# EAGLE board F2CE_V3_Main (EAGLE 9.6.2), part 1 of 2
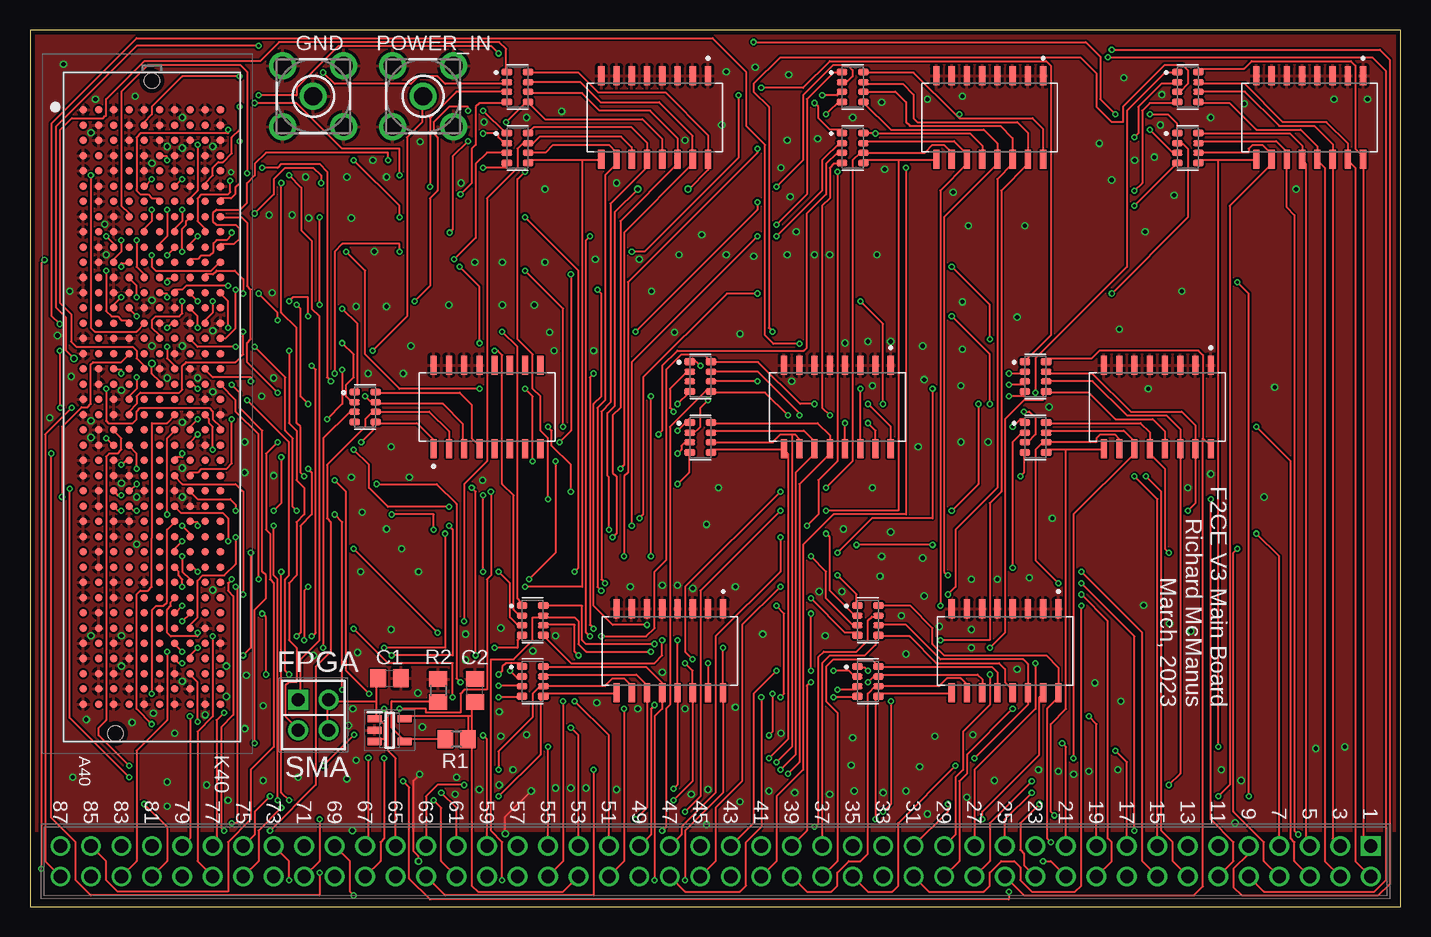
[diagram p4: board, top side]
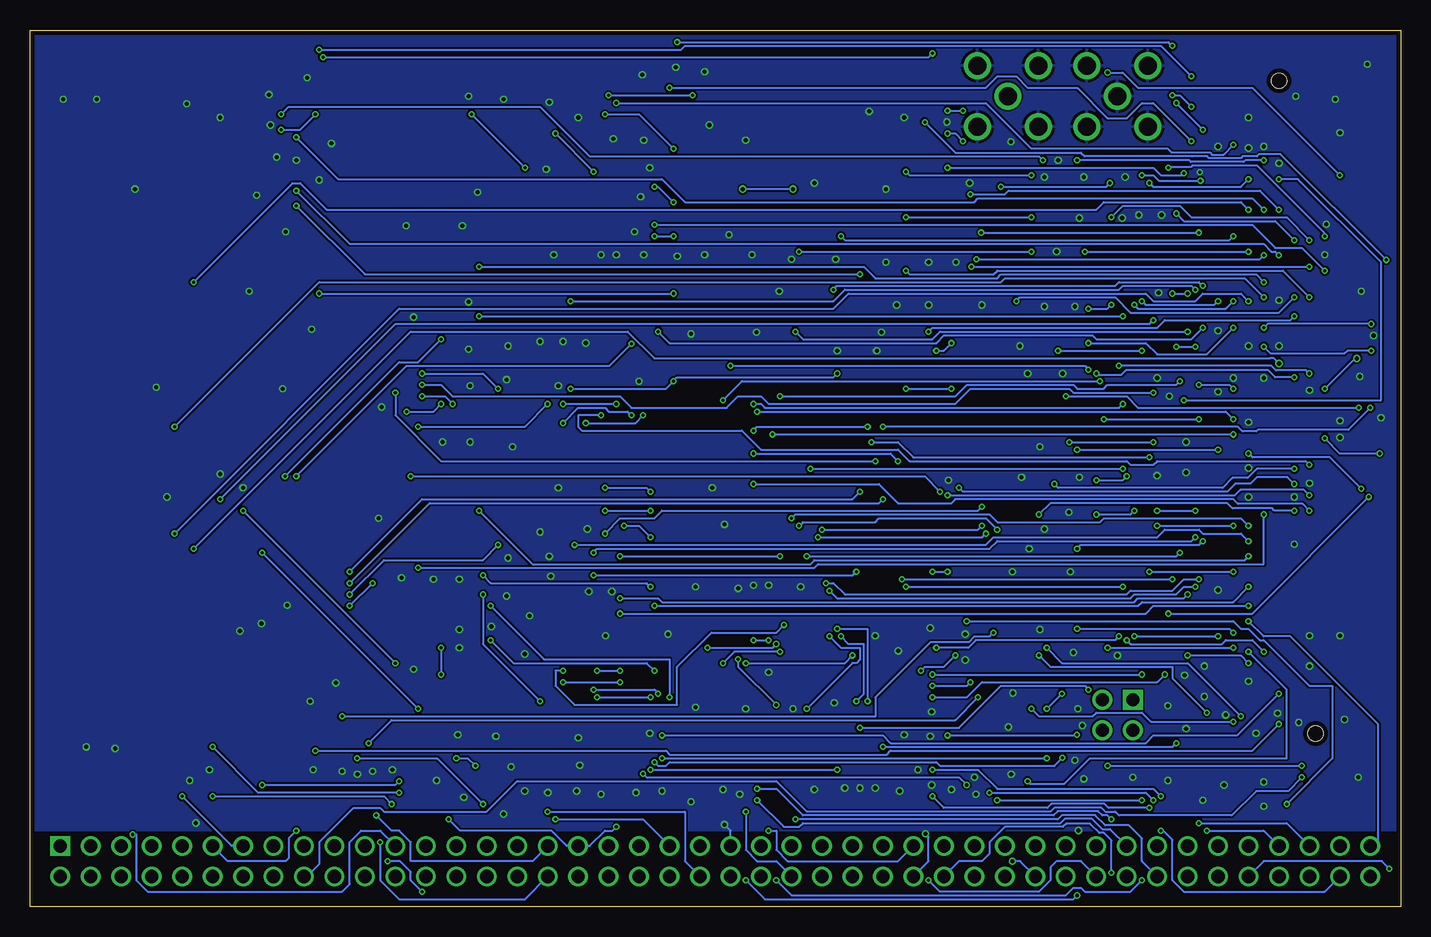
[diagram p5: board, bottom side, seen from below]

Size 114.28 x 73.08 mm. Coordinates in mm from the lower left corner, seen from the top.
Outline: 0,0 114.28,0 114.28,73.08 0,73.08 0,0
Copper layers (1*16): Top 0.035559375mm / dielectric 1.6mm / Bottom 0.035559375mm
Design rules "oshpark-2layer *": minimum track width 6mil, minimum drill 10mil, track to track 6mil, track to pad 6mil, pad to pad 6mil, via to via 6mil, smd to smd 6mil, copper to edge 15mil, drill to drill 6mil, minimum pad ring 5mil, minimum via ring 5mil, stop-mask expansion 2.5mil, vias tented up to drill 15mil, thermal gap 10mil

## Footprints (pad centres in the part's own frame; a part is rotated, then mirrored left to right if it is on the bottom)
RESCAXE80P320X160X70-8N = smd 0.9 x 0.61: 1 -0.885,1.24; 4 -0.885,-1.24; 5 0.885,-1.24; 8 0.885,1.24 | smd 0.9 x 0.53: 2 -0.885,0.4; 3 -0.885,-0.4; 6 0.885,-0.4; 7 0.885,0.4
SOIC127P762X240-16N = smd 1.59 x 0.6: 1 -3.495,4.445; 2 -3.495,3.175; 3 -3.495,1.905; 4 -3.495,0.635; 5 -3.495,-0.635; 6 -3.495,-1.905; 7 -3.495,-3.175; 8 -3.495,-4.445; 9 3.495,-4.445; 10 3.495,-3.175; 11 3.495,-1.905; 12 3.495,-0.635; 13 3.495,0.635; 14 3.495,1.905; 15 3.495,3.175; 16 3.495,4.445
C0805 = smd 1.3 x 1.5: 1 -0.95,0; 2 0.95,0
LTI-SASF54GT = drill 1.5 pad 2.2: 1 0,0; 2 -2.54,2.54; 3 2.54,2.54; 4 2.54,-2.54; 5 -2.54,-2.54
SOT95P280X100-5N = smd 1.15 x 0.6: 1 -1.25,0.95; 2 -1.25,0; 3 -1.25,-0.95; 4 1.25,-0.95; 5 1.25,0.95
88-PIN-HEADER = drill 1.1 pad 1.65 square: 1 0,109.22 | drill 1.1 pad 1.65: 2 2.54,109.22; 3 0,106.68; 4 2.54,106.68; 5 0,104.14; 6 2.54,104.14; 7 0,101.6; 8 2.54,101.6; 9 0,99.06; 10 2.54,99.06; 11 0,96.52; 12 2.54,96.52; 13 0,93.98; 14 2.54,93.98; 15 0,91.44; 16 2.54,91.44; 17 0,88.9; 18 2.54,88.9; 19 0,86.36; 20 2.54,86.36; 21 0,83.82; 22 2.54,83.82; 23 0,81.28; 24 2.54,81.28; 25 0,78.74; 26 2.54,78.74; 27 0,76.2; 28 2.54,76.2; 29 0,73.66; 30 2.54,73.66; 31 0,71.12; 32 2.54,71.12; 33 0,68.58; 34 2.54,68.58; 35 0,66.04; 36 2.54,66.04; 37 0,63.5; 38 2.54,63.5; 39 0,60.96; 40 2.54,60.96; 41 0,58.42; 42 2.54,58.42; 43 0,55.88; 44 2.54,55.88; 45 0,53.34; 46 2.54,53.34; 47 0,50.8; 48 2.54,50.8; 49 0,48.26; 50 2.54,48.26; 51 0,45.72; 52 2.54,45.72; 53 0,43.18; 54 2.54,43.18; 55 0,40.64; 56 2.54,40.64; 57 0,38.1; 58 2.54,38.1; 59 0,35.56; 60 2.54,35.56; 61 0,33.02; 62 2.54,33.02; 63 0,30.48; 64 2.54,30.48; 65 0,27.94; 66 2.54,27.94; 67 0,25.4; 68 2.54,25.4; 69 0,22.86; 70 2.54,22.86; 71 0,20.32; 72 2.54,20.32; 73 0,17.78; 74 2.54,17.78; 75 0,15.24; 76 2.54,15.24; 77 0,12.7; 78 2.54,12.7; 79 0,10.16; 80 2.54,10.16; 81 0,7.62; 82 2.54,7.62; 83 0,5.08; 84 2.54,5.08; 85 0,2.54; 86 2.54,2.54; 87 0,0; 88 2.54,0
ASP13460201 = smd 0.64 x 0.64: A1 24.765,5.715; A2 23.495,5.715; A3 22.225,5.715; A4 20.955,5.715; A5 19.685,5.715; A6 18.415,5.715; A7 17.145,5.715; A8 15.875,5.715; A9 14.605,5.715; A10 13.335,5.715; A11 12.065,5.715; A12 10.795,5.715; A13 9.525,5.715; A14 8.255,5.715; A15 6.985,5.715; A16 5.715,5.715; A17 4.445,5.715; A18 3.175,5.715; A19 1.905,5.715; A20 0.635,5.715; A21 -0.635,5.715; A22 -1.905,5.715; A23 -3.175,5.715; A24 -4.445,5.715; A25 -5.715,5.715; A26 -6.985,5.715; A27 -8.255,5.715; A28 -9.525,5.715; A29 -10.795,5.715; A30 -12.065,5.715; A31 -13.335,5.715; A32 -14.605,5.715; A33 -15.875,5.715; A34 -17.145,5.715; A35 -18.415,5.715; A36 -19.685,5.715; A37 -20.955,5.715; A38 -22.225,5.715; A39 -23.495,5.715; A40 -24.765,5.715; B1 24.765,4.445; B2 23.495,4.445; B3 22.225,4.445; B4 20.955,4.445; B5 19.685,4.445; B6 18.415,4.445; B7 17.145,4.445; B8 15.875,4.445; B9 14.605,4.445; B10 13.335,4.445; B11 12.065,4.445; B12 10.795,4.445; B13 9.525,4.445; B14 8.255,4.445; B15 6.985,4.445; B16 5.715,4.445; B17 4.445,4.445; B18 3.175,4.445; B19 1.905,4.445; B20 0.635,4.445; B21 -0.635,4.445; B22 -1.905,4.445; B23 -3.175,4.445; B24 -4.445,4.445; B25 -5.715,4.445; B26 -6.985,4.445; B27 -8.255,4.445; B28 -9.525,4.445; B29 -10.795,4.445; B30 -12.065,4.445; B31 -13.335,4.445; B32 -14.605,4.445; B33 -15.875,4.445; B34 -17.145,4.445; B35 -18.415,4.445; B36 -19.685,4.445; B37 -20.955,4.445; B38 -22.225,4.445; B39 -23.495,4.445; B40 -24.765,4.445; C1 24.765,3.175; C2 23.495,3.175; C3 22.225,3.175; C4 20.955,3.175; C5 19.685,3.175; C6 18.415,3.175; C7 17.145,3.175; C8 15.875,3.175; C9 14.605,3.175; C10 13.335,3.175; C11 12.065,3.175; C12 10.795,3.175; C13 9.525,3.175; C14 8.255,3.175; C15 6.985,3.175; C16 5.715,3.175; C17 4.445,3.175; C18 3.175,3.175; C19 1.905,3.175; C20 0.635,3.175; C21 -0.635,3.175; C22 -1.905,3.175; C23 -3.175,3.175; C24 -4.445,3.175; C25 -5.715,3.175; C26 -6.985,3.175; C27 -8.255,3.175; C28 -9.525,3.175; C29 -10.795,3.175; C30 -12.065,3.175; C31 -13.335,3.175; C32 -14.605,3.175; C33 -15.875,3.175; C34 -17.145,3.175; C35 -18.415,3.175; C36 -19.685,3.175; C37 -20.955,3.175; C38 -22.225,3.175; C39 -23.495,3.175; C40 -24.765,3.175; D1 24.765,1.905; D2 23.495,1.905; D3 22.225,1.905; D4 20.955,1.905; D5 19.685,1.905; D6 18.415,1.905; D7 17.145,1.905; D8 15.875,1.905; D9 14.605,1.905; D10 13.335,1.905; D11 12.065,1.905; D12 10.795,1.905; D13 9.525,1.905; D14 8.255,1.905; D15 6.985,1.905; D16 5.715,1.905; D17 4.445,1.905; D18 3.175,1.905; D19 1.905,1.905; D20 0.635,1.905; D21 -0.635,1.905; D22 -1.905,1.905; D23 -3.175,1.905; D24 -4.445,1.905; D25 -5.715,1.905; D26 -6.985,1.905; D27 -8.255,1.905; D28 -9.525,1.905; D29 -10.795,1.905; D30 -12.065,1.905; D31 -13.335,1.905; D32 -14.605,1.905; D33 -15.875,1.905; D34 -17.145,1.905; D35 -18.415,1.905; D36 -19.685,1.905; D37 -20.955,1.905; D38 -22.225,1.905; D39 -23.495,1.905; D40 -24.765,1.905; E1 24.765,0.635; E2 23.495,0.635; E3 22.225,0.635; E4 20.955,0.635; E5 19.685,0.635; E6 18.415,0.635; E7 17.145,0.635; E8 15.875,0.635; E9 14.605,0.635; E10 13.335,0.635; E11 12.065,0.635; E12 10.795,0.635; E13 9.525,0.635; E14 8.255,0.635; E15 6.985,0.635; E16 5.715,0.635; E17 4.445,0.635; E18 3.175,0.635; E19 1.905,0.635; E20 0.635,0.635; E21 -0.635,0.635; E22 -1.905,0.635; E23 -3.175,0.635; E24 -4.445,0.635; E25 -5.715,0.635; E26 -6.985,0.635; E27 -8.255,0.635; E28 -9.525,0.635; E29 -10.795,0.635; E30 -12.065,0.635; E31 -13.335,0.635; E32 -14.605,0.635; E33 -15.875,0.635; E34 -17.145,0.635; E35 -18.415,0.635; E36 -19.685,0.635; E37 -20.955,0.635; E38 -22.225,0.635; E39 -23.495,0.635; E40 -24.765,0.635; F1 24.765,-0.635; F2 23.495,-0.635; F3 22.225,-0.635; F4 20.955,-0.635; F5 19.685,-0.635; F6 18.415,-0.635; F7 17.145,-0.635; F8 15.875,-0.635; F9 14.605,-0.635; F10 13.335,-0.635; F11 12.065,-0.635; F12 10.795,-0.635; F13 9.525,-0.635; F14 8.255,-0.635; F15 6.985,-0.635; F16 5.715,-0.635; F17 4.445,-0.635; F18 3.175,-0.635; F19 1.905,-0.635; F20 0.635,-0.635; F21 -0.635,-0.635; F22 -1.905,-0.635; F23 -3.175,-0.635; F24 -4.445,-0.635; F25 -5.715,-0.635; F26 -6.985,-0.635; F27 -8.255,-0.635; F28 -9.525,-0.635; F29 -10.795,-0.635; F30 -12.065,-0.635; F31 -13.335,-0.635; F32 -14.605,-0.635; F33 -15.875,-0.635; F34 -17.145,-0.635; F35 -18.415,-0.635; F36 -19.685,-0.635; F37 -20.955,-0.635; F38 -22.225,-0.635; F39 -23.495,-0.635; F40 -24.765,-0.635; G1 24.765,-1.905; G2 23.495,-1.905; G3 22.225,-1.905; G4 20.955,-1.905; G5 19.685,-1.905; G6 18.415,-1.905; G7 17.145,-1.905; G8 15.875,-1.905; G9 14.605,-1.905; G10 13.335,-1.905; G11 12.065,-1.905; G12 10.795,-1.905; G13 9.525,-1.905; G14 8.255,-1.905; G15 6.985,-1.905; G16 5.715,-1.905; G17 4.445,-1.905; G18 3.175,-1.905; G19 1.905,-1.905; G20 0.635,-1.905; G21 -0.635,-1.905; G22 -1.905,-1.905; G23 -3.175,-1.905; G24 -4.445,-1.905; G25 -5.715,-1.905; G26 -6.985,-1.905; G27 -8.255,-1.905; G28 -9.525,-1.905; G29 -10.795,-1.905; G30 -12.065,-1.905; G31 -13.335,-1.905; G32 -14.605,-1.905; G33 -15.875,-1.905; G34 -17.145,-1.905; G35 -18.415,-1.905; G36 -19.685,-1.905; G37 -20.955,-1.905; G38 -22.225,-1.905; G39 -23.495,-1.905; G40 -24.765,-1.905; H1 24.765,-3.175; H2 23.495,-3.175; H3 22.225,-3.175; H4 20.955,-3.175; H5 19.685,-3.175; H6 18.415,-3.175; H7 17.145,-3.175; H8 15.875,-3.175; H9 14.605,-3.175; H10 13.335,-3.175; H11 12.065,-3.175; H12 10.795,-3.175; H13 9.525,-3.175; H14 8.255,-3.175; H15 6.985,-3.175; H16 5.715,-3.175; H17 4.445,-3.175; H18 3.175,-3.175; H19 1.905,-3.175; H20 0.635,-3.175; H21 -0.635,-3.175; H22 -1.905,-3.175; H23 -3.175,-3.175; H24 -4.445,-3.175; H25 -5.715,-3.175; H26 -6.985,-3.175; H27 -8.255,-3.175; H28 -9.525,-3.175; H29 -10.795,-3.175; H30 -12.065,-3.175; H31 -13.335,-3.175; H32 -14.605,-3.175; H33 -15.875,-3.175; H34 -17.145,-3.175; H35 -18.415,-3.175; H36 -19.685,-3.175; H37 -20.955,-3.175; H38 -22.225,-3.175; H39 -23.495,-3.175; H40 -24.765,-3.175; J1 24.765,-4.445; J2 23.495,-4.445; J3 22.225,-4.445; J4 20.955,-4.445; J5 19.685,-4.445; J6 18.415,-4.445; J7 17.145,-4.445; J8 15.875,-4.445; J9 14.605,-4.445; J10 13.335,-4.445; J11 12.065,-4.445; J12 10.795,-4.445; J13 9.525,-4.445; J14 8.255,-4.445; J15 6.985,-4.445; J16 5.715,-4.445; J17 4.445,-4.445; J18 3.175,-4.445; J19 1.905,-4.445; J20 0.635,-4.445; J21 -0.635,-4.445; J22 -1.905,-4.445; J23 -3.175,-4.445; J24 -4.445,-4.445; J25 -5.715,-4.445; J26 -6.985,-4.445; J27 -8.255,-4.445; J28 -9.525,-4.445; J29 -10.795,-4.445; J30 -12.065,-4.445; J31 -13.335,-4.445; J32 -14.605,-4.445; J33 -15.875,-4.445; J34 -17.145,-4.445; J35 -18.415,-4.445; J36 -19.685,-4.445; J37 -20.955,-4.445; J38 -22.225,-4.445; J39 -23.495,-4.445; J40 -24.765,-4.445; K1 24.765,-5.715; K2 23.495,-5.715; K3 22.225,-5.715; K4 20.955,-5.715; K5 19.685,-5.715; K6 18.415,-5.715; K7 17.145,-5.715; K8 15.875,-5.715; K9 14.605,-5.715; K10 13.335,-5.715; K11 12.065,-5.715; K12 10.795,-5.715; K13 9.525,-5.715; K14 8.255,-5.715; K15 6.985,-5.715; K16 5.715,-5.715; K17 4.445,-5.715; K18 3.175,-5.715; K19 1.905,-5.715; K20 0.635,-5.715; K21 -0.635,-5.715; K22 -1.905,-5.715; K23 -3.175,-5.715; K24 -4.445,-5.715; K25 -5.715,-5.715; K26 -6.985,-5.715; K27 -8.255,-5.715; K28 -9.525,-5.715; K29 -10.795,-5.715; K30 -12.065,-5.715; K31 -13.335,-5.715; K32 -14.605,-5.715; K33 -15.875,-5.715; K34 -17.145,-5.715; K35 -18.415,-5.715; K36 -19.685,-5.715; K37 -20.955,-5.715; K38 -22.225,-5.715; K39 -23.495,-5.715; K40 -24.765,-5.715 | hole 1.27: -27.19,3.046; 27.19,0
HDRV4W64P254_2X2_521X508X851P = drill 1.1 pad 1.65 square: 1 0,0 | drill 1.1 pad 1.65: 2 0,2.54; 3 2.54,0; 4 2.54,2.54
R0805 = smd 1.3 x 1.5: 1 -0.95,0; 2 0.95,0

## Placement (x,y rotation side)
4BITVD1:R1  YC164-FR-0760R4L  [RESCAXE80P320X160X70-8N]  27.94,41.66 0 top
4BITVD1:RN1  4816P-1-121LF  [SOIC127P762X240-16N]  38.1,41.66 90 top
8BITVD1:R1  YC164-FR-0760R4L  [RESCAXE80P320X160X70-8N]  96.52,68.33 0 top
8BITVD1:R2  YC164-FR-0760R4L  [RESCAXE80P320X160X70-8N]  96.52,63.25 0 top
8BITVD1:RN1  4816P-1-121LF  [SOIC127P762X240-16N]  106.68,65.79 270 top
8BITVD2:R1  YC164-FR-0760R4L  [RESCAXE80P320X160X70-8N]  83.82,44.2 0 top
8BITVD2:R2  YC164-FR-0760R4L  [RESCAXE80P320X160X70-8N]  83.82,39.12 0 top
8BITVD2:RN1  4816P-1-121LF  [SOIC127P762X240-16N]  93.98,41.66 270 top
8BITVD3:R1  YC164-FR-0760R4L  [RESCAXE80P320X160X70-8N]  69.85,23.88 0 top
8BITVD3:R2  YC164-FR-0760R4L  [RESCAXE80P320X160X70-8N]  69.85,18.8 0 top
8BITVD3:RN1  4816P-1-121LF  [SOIC127P762X240-16N]  81.28,21.34 270 top
8BITVD4:R1  YC164-FR-0760R4L  [RESCAXE80P320X160X70-8N]  68.58,68.33 0 top
8BITVD4:R2  YC164-FR-0760R4L  [RESCAXE80P320X160X70-8N]  68.58,63.25 0 top
8BITVD4:RN1  4816P-1-121LF  [SOIC127P762X240-16N]  80.01,65.79 270 top
8BITVD5:R1  YC164-FR-0760R4L  [RESCAXE80P320X160X70-8N]  55.88,44.2 0 top
8BITVD5:R2  YC164-FR-0760R4L  [RESCAXE80P320X160X70-8N]  55.88,39.12 0 top
8BITVD5:RN1  4816P-1-121LF  [SOIC127P762X240-16N]  67.31,41.66 270 top
8BITVD6:R1  YC164-FR-0760R4L  [RESCAXE80P320X160X70-8N]  41.91,23.88 0 top
8BITVD6:R2  YC164-FR-0760R4L  [RESCAXE80P320X160X70-8N]  41.91,18.8 0 top
8BITVD6:RN1  4816P-1-121LF  [SOIC127P762X240-16N]  53.34,21.34 270 top
8BITVD7:R1  YC164-FR-0760R4L  [RESCAXE80P320X160X70-8N]  40.64,68.33 0 top
8BITVD7:R2  YC164-FR-0760R4L  [RESCAXE80P320X160X70-8N]  40.64,63.25 0 top
8BITVD7:RN1  4816P-1-121LF  [SOIC127P762X240-16N]  52.07,65.79 270 top
C1  1 uF  [C0805]  29.97,19.05 0 top
C2  1 uF  [C0805]  37.08,18.03 90 top
GND  LTI-SASF54GT  [LTI-SASF54GT]  23.62,67.56 0 top
IC1  ADP171AUJZ-R7  [SOT95P280X100-5N]  29.97,14.73 0 top
J1  88-PIN-HEADER  [88-PIN-HEADER]  2.54,5.08 270 top
J2  ASP-134602-01  [ASP13460201]  10.16,41.66 90 top
J3  70287-1098  [HDRV4W64P254_2X2_521X508X851P]  22.35,17.27 270 top
POWER_IN  LTI-SASF54GT  [LTI-SASF54GT]  32.77,67.56 0 top
R1  200  [R0805]  35.56,13.97 180 top
R2  140  [R0805]  34.04,18.03 270 top